# EAGLE design halloween-mask-v2 (EAGLE 9.6.2)
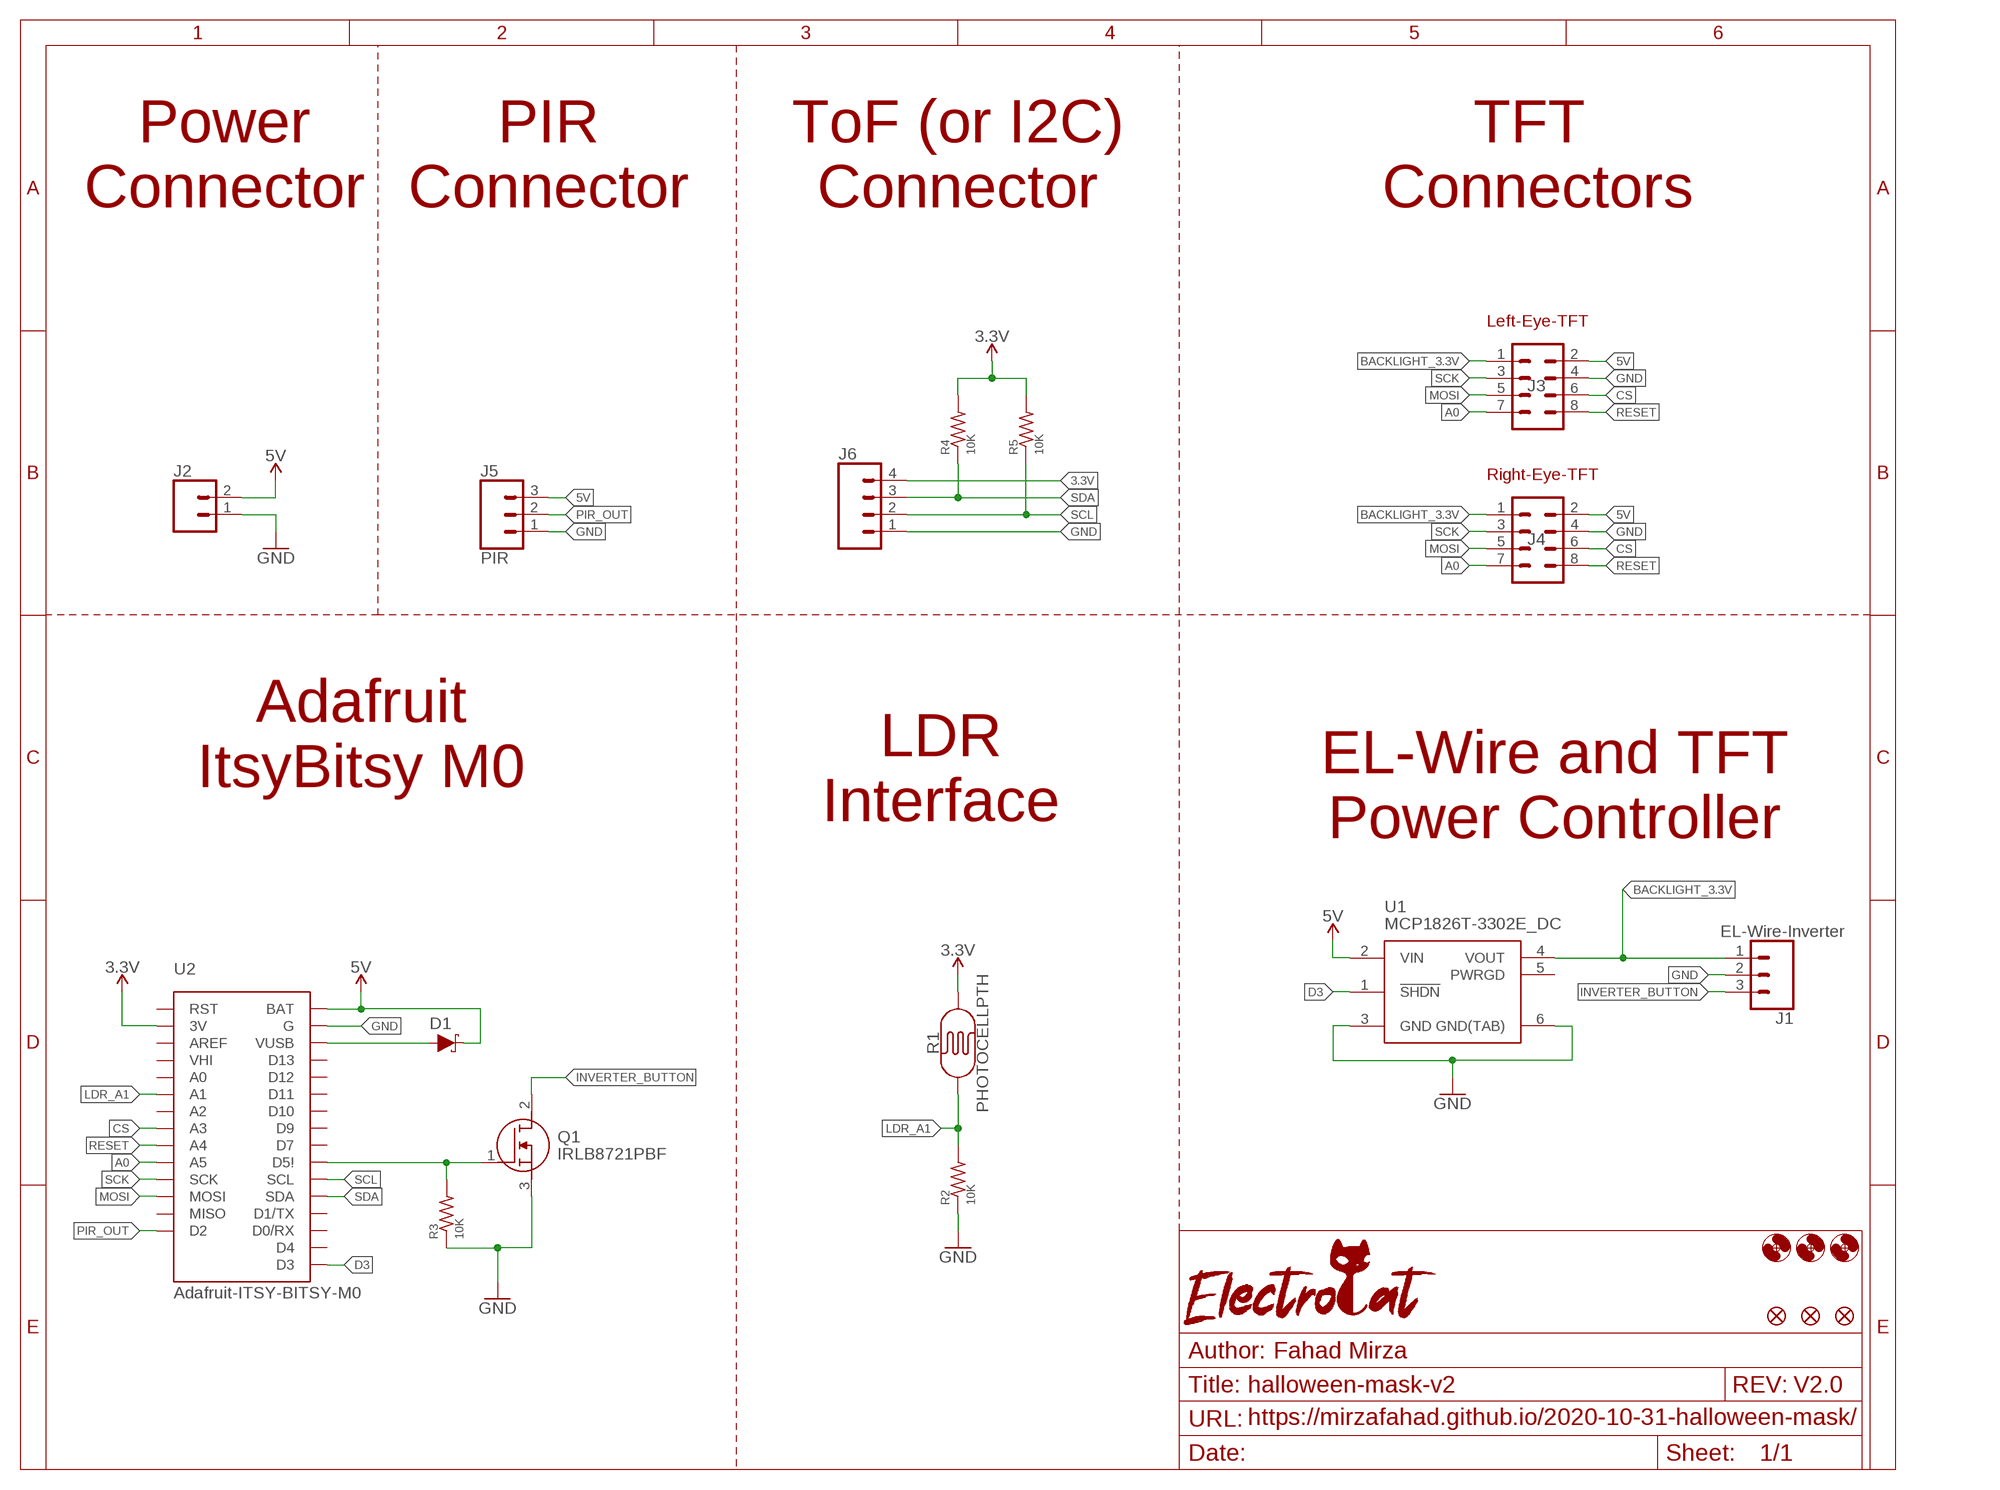
[diagram p0: schematic, sheet 1]

## Parts
D1  DIODE-SCHOTTKY-MBR130T1G  [SOD-123]
FD1  FIDUCIAL0.2MM  [FIDUCIAL-0.2MM]
FD2  FIDUCIAL0.2MM  [FIDUCIAL-0.2MM]
FD3  FIDUCIAL0.2MM  [FIDUCIAL-0.2MM]
H1  MOUNT-HOLE2.8  [2,8]
H2  MOUNT-HOLE2.8  [2,8]
H4  MOUNT-HOLE2.8  [2,8]
J1  EL-Wire-Inverter  CONN_03  [1X03]
J2  CONN_02LOCK  [1X02_LOCK]
J3  CONN_04X2  [2X4]
J4  CONN_04X2  [2X4]
J5  PIR  CONN_03LOCK  [1X03_LOCK]
J6  CONN_04PTH  [1X04]
Q1  IRLB8721PBF  [TO254P483X1016X1994-3P]
R1  PHOTOCELLPTH  [PHOTOCELL]
R2  10K  SMD-RES-1206  [R1206]
R3  10K  SMD-RES-1206  [R1206]
R4  10K  SMD-RES-1206  [R1206]
R5  10K  SMD-RES-1206  [R1206]
U1  MCP1826T-3302E_DC  [SOT127P706X180-6N]
U2  Adafruit-ITSY-BITSY-M0  ITSY-BITSY-LESS-PINS  [ITSY-BITSY-LESS-PINS]

## Nets
3.3V: J6.4 R1.2 R4.2 R5.2 U2.P2(3V)
5V: D1.2(C) J2.2 J3.2 J4.2 J5.3 U1.2(VIN) U2.P28(BAT)
A0: J3.7 J4.7 U2.P10(A5)
BACKLIGHT_3.3V: J1.1 J3.1 J4.1 U1.4(VOUT)
CS: J3.6 J4.6 U2.P8(A3)
D3: U1.1(!SHDN) U2.18(D3)
GND: J1.2 J2.1 J3.4 J4.4 J5.1 J6.1 Q1.3(S) R2.1 R3.1 U1.3(GND) U1.6(GND(TAB)) U2.P27(G)
INVERTER_BUTTON: J1.3 Q1.2(D)
LDR_A1: R1.1 R2.2 U2.P6(A1)
MOSI: J3.5 J4.5 U2.P12(MOSI)
N$1: D1.1(A) U2.P26(VUSB)
N$3: Q1.1(G) R3.2 U2.P19(D5!)
PIR_OUT: J5.2 U2.P14(D2)
RESET: J3.8 J4.8 U2.P9(A4)
SCK: J3.3 J4.3 U2.P11(SCK)
SCL: J6.2 R5.1 U2.P18(SCL)
SDA: J6.3 R4.1 U2.P17(SDA)
Unconnected: U1.5(PWRGD) U2.19(D4) U2.P1(RST) U2.P3(AREF) U2.P4(VHI) U2.P5(A0) U2.P7(A2) U2.P13(MISO) U2.P15(D0/RX) U2.P16(D1/TX) U2.P20(D7) U2.P21(D9) U2.P22(D10) U2.P23(D11) U2.P24(D12) U2.P25(D13)

## Notes on the sheet
- Power
  Connector
- PIR
  Connector
- ToF (or I2C)
  Connector
- TFT 
  Connectors
- Left-Eye-TFT
- Right-Eye-TFT
- Adafruit
  ItsyBitsy M0
- LDR
  Interface
- EL-Wire and TFT
  Power Controller
- V2.0
- https://mirzafahad.github.io/2020-10-31-halloween-mask/

## Library data of the parts
D1 = Personal_DiscreteSemi:DIODE-SCHOTTKY: Schottky diode A Schottky diode is a semiconductor diode which has a low forward voltage drop and a very fast switching action.
FD1-FD3 = SparkFun-Aesthetics:FIDUCIAL: Fiducial Alignment Points Point-of-reference for pick-and-place machines and other optical instruments.
H1 H2 H4 = Personal_Connectors:MOUNT-HOLE: MOUNTING HOLE with drill center marker
J1 = SparkFun-Connectors:CONN_03: Multi connection point. Often used as Generic Header-pin footprint for 0.1 inch spaced/style header connections On any of the 0.1 inch spaced packages, you can populate with these: Break Away Headers - Straight <https://www.sparkfun.com/products/116> (PRT-00116) Break Away Male Headers - Right Angle <https://www.sparkfun.com/products/553> (PRT-00553) Female Headers <https://www.sparkfun.com/products/115> (PRT-00115) Break Away Headers - Machine Pin <https://www.sparkfun.com/products/117> (PRT-00117) Break Away Female Headers - Swiss Machine Pin <https://www.sparkfun.com/products/743> (PRT-00743) Stackable Header - 3 Pin (Female, 0.1") <https://www.sparkfun.com/products/13875> (PRT-13875) For SCREWTERMINALS and SPRING TERMINALS visit here: Screw Terimnals on SparkFun.com <https://www.sparkfun.com/search/results?term=Screw+Terminals> (5mm/3.5mm/2.54mm spacing) This device is also useful as a general connection point to wire up your design to another part of your project. Our various solder wires solder well into these plated through hole pads. Hook-Up Wire - Assortment (Stranded, 22 AWG) <https://www.sparkfun.com/products/11375> (PRT-11375) Hook-Up Wire - Assortment (Solid Core, 22 AWG) <https://www.sparkfun.com/products/11367> (PRT-11367) View the entire wire category on our website here <https://www.sparkfun.com/categories/141> Special notes: Molex polarized connector foot print use with SKU : PRT-08232 with associated crimp pins and housings.; PROD_ID: XXX-00000; VALUE: 455-1750-1-ND
J2 = SparkFun-Connectors:CONN_02: Multi connection point. Often used as Generic Header-pin footprint for 0.1 inch spaced/style header connections On any of the 0.1 inch spaced packages, you can populate with these: Break Away Headers - Straight <https://www.sparkfun.com/products/116> (PRT-00116) Break Away Male Headers - Right Angle <https://www.sparkfun.com/products/553> (PRT-00553) Female Headers <https://www.sparkfun.com/products/115> (PRT-00115) Break Away Headers - Machine Pin <https://www.sparkfun.com/products/117> (PRT-00117) Break Away Female Headers - Swiss Machine Pin <https://www.sparkfun.com/products/743> (PRT-00743) For SCREWTERMINALS and SPRING TERMINALS visit here: Screw Terimnals on SparkFun.com <https://www.sparkfun.com/search/results?term=Screw+Terminals> (5mm/3.5mm/2.54mm spacing) This device is also useful as a general connection point to wire up your design to another part of your project. Our various solder wires solder well into these plated through hole pads. Hook-Up Wire - Assortment (Stranded, 22 AWG) <https://www.sparkfun.com/products/11375> (PRT-11375) Hook-Up Wire - Assortment (Solid Core, 22 AWG) <https://www.sparkfun.com/products/11367> (PRT-11367) View the entire wire category on our website here <https://www.sparkfun.com/categories/141> Special notes: Molex polarized connector foot print use with: PRT-08233 with associated crimp pins and housings. 2.54_SCREWTERM for use with PRT-10571. 3.5mm Screw Terminal footprints for PRT-08084 5mm Screw Terminal footprints for use with PRT-08432
J3 J4 = SparkFun-Connectors:CONN_04X2: Multi connection point. Often used as Generic Header-pin footprint for 0.1 inch spaced/style header connections On any of the 0.1 inch spaced packages, you can populate with these: Break Away Headers - Straight <https://www.sparkfun.com/products/116> (PRT-00116) Break Away Male Headers - Right Angle <https://www.sparkfun.com/products/553> (PRT-00553) Female Headers <https://www.sparkfun.com/products/115> (PRT-00115) Break Away Headers - Machine Pin <https://www.sparkfun.com/products/117> (PRT-00117) Break Away Female Headers - Swiss Machine Pin <https://www.sparkfun.com/products/743> (PRT-00743)
J5 = SparkFun-Connectors:CONN_03: Multi connection point. Often used as Generic Header-pin footprint for 0.1 inch spaced/style header connections On any of the 0.1 inch spaced packages, you can populate with these: Break Away Headers - Straight <https://www.sparkfun.com/products/116> (PRT-00116) Break Away Male Headers - Right Angle <https://www.sparkfun.com/products/553> (PRT-00553) Female Headers <https://www.sparkfun.com/products/115> (PRT-00115) Break Away Headers - Machine Pin <https://www.sparkfun.com/products/117> (PRT-00117) Break Away Female Headers - Swiss Machine Pin <https://www.sparkfun.com/products/743> (PRT-00743) Stackable Header - 3 Pin (Female, 0.1") <https://www.sparkfun.com/products/13875> (PRT-13875) For SCREWTERMINALS and SPRING TERMINALS visit here: Screw Terimnals on SparkFun.com <https://www.sparkfun.com/search/results?term=Screw+Terminals> (5mm/3.5mm/2.54mm spacing) This device is also useful as a general connection point to wire up your design to another part of your project. Our various solder wires solder well into these plated through hole pads. Hook-Up Wire - Assortment (Stranded, 22 AWG) <https://www.sparkfun.com/products/11375> (PRT-11375) Hook-Up Wire - Assortment (Solid Core, 22 AWG) <https://www.sparkfun.com/products/11367> (PRT-11367) View the entire wire category on our website here <https://www.sparkfun.com/categories/141> Special notes: Molex polarized connector foot print use with SKU : PRT-08232 with associated crimp pins and housings.
J6 = SparkFun-Connectors:CONN_04: Multi connection point. Often used as Generic Header-pin footprint for 0.1 inch spaced/style header connections On any of the 0.1 inch spaced packages, you can populate with these: Break Away Headers - Straight <https://www.sparkfun.com/products/116> (PRT-00116) Break Away Male Headers - Right Angle <https://www.sparkfun.com/products/553> (PRT-00553) Female Headers <https://www.sparkfun.com/products/115> (PRT-00115) Break Away Headers - Machine Pin <https://www.sparkfun.com/products/117> (PRT-00117) Break Away Female Headers - Swiss Machine Pin <https://www.sparkfun.com/products/743> (PRT-00743) For SCREWTERMINALS and SPRING TERMINALS visit here: Screw Terimnals on SparkFun.com <https://www.sparkfun.com/search/results?term=Screw+Terminals> (5mm/3.5mm/2.54mm spacing) This device is also useful as a general connection point to wire up your design to another part of your project. Our various solder wires solder well into these plated through hole pads. Hook-Up Wire - Assortment (Stranded, 22 AWG) <https://www.sparkfun.com/products/11375> (PRT-11375) Hook-Up Wire - Assortment (Solid Core, 22 AWG) <https://www.sparkfun.com/products/11367> (PRT-11367) View the entire wire category on our website here <https://www.sparkfun.com/categories/141> Special notes: Molex polarized connector foot print use with SKU : PRT-08231 with associated crimp pins and housings. 1MM SMD Version SKU: PRT-10208; PROD_ID: CONN-09696
Q1 = SamacSys_Parts2:IRLB8721PBF: International Rectifier IRLB8721PBF N-channel MOSFET Transistor, 62 A, 30 V, 3-Pin TO-220AB Source: Datasheet <https://cdn-shop.adafruit.com/datasheets/irlb8721pbf.pdf>; ARROW_PART_NUMBER: IRLB8721PBF; DESCRIPTION: International Rectifier IRLB8721PBF N-channel MOSFET Transistor, 62 A, 30 V, 3-Pin TO-220AB; HEIGHT: 4.83mm; MANUFACTURER_NAME: International Rectifier; MANUFACTURER_PART_NUMBER: IRLB8721PBF
R1 = SparkFun-Sensors:PHOTOCELL: Photocell (Photodetector, Photo Resistor, CdS) This is a very small light sensor. A photocell changes (also called a photodetector, photo resistor, CdS or photoconductive cell) resistance depending on the amount of light it is exposed to. These little sensors make great ambient light triggers (when light in the room turns on, do something). Datasheet <http://cdn.sparkfun.com/datasheets/Sensors/LightImaging/SEN-09088.pdf> SparkFun Products Mini Photocell <https://www.sparkfun.com/products/9088> (SEN-09088); PROD_ID: COMP-09129; SF_ID: SEN-09088
R2-R5 = OPL_Resistor:SMD-RES-1206
U1 = Personal_ICs-Regulators:MCP1826T-3302E_DC: LDO Regulator 1A 3.3V PG SOT223-5 MCP1826T-3302E/DC, Low Dropout Voltage Regulator, 1A, 3.3 V +/-2%, 2.3 6 Vin, 6-Pin SOT-223 Source: Datasheet <http://ww1.microchip.com/downloads/en/DeviceDoc/22057B.pdf>; ARROW_PART_NUMBER: MCP1826T-3302E/DC; ARROW_PRICE-STOCK: https://www.arrow.com/en/products/mcp1826t-3302edc/microchip-technology; DESCRIPTION: LDO Regulator 1A 3.3V PG SOT223-5 MCP1826T-3302E/DC, Low Dropout Voltage Regulator, 1A, 3.3 V +/-2%, 2.3 6 Vin, 6-Pin SOT-223; HEIGHT: 1.8mm; MANUFACTURER_NAME: Microchip; MANUFACTURER_PART_NUMBER: MCP1826T-3302E/DC; MOUSER_PART_NUMBER: 579-MCP1826T-3302EDC; MOUSER_PRICE-STOCK: https://www.mouser.co.uk/ProductDetail/Microchip-Technology/MCP1826T-3302E-DC?qs=php1hWwkCL6wXd5EvIo2DQ%3D%3D
U2 = Personal_ARDUINO:ITSY-BITSY-LESS-PINS

## Board
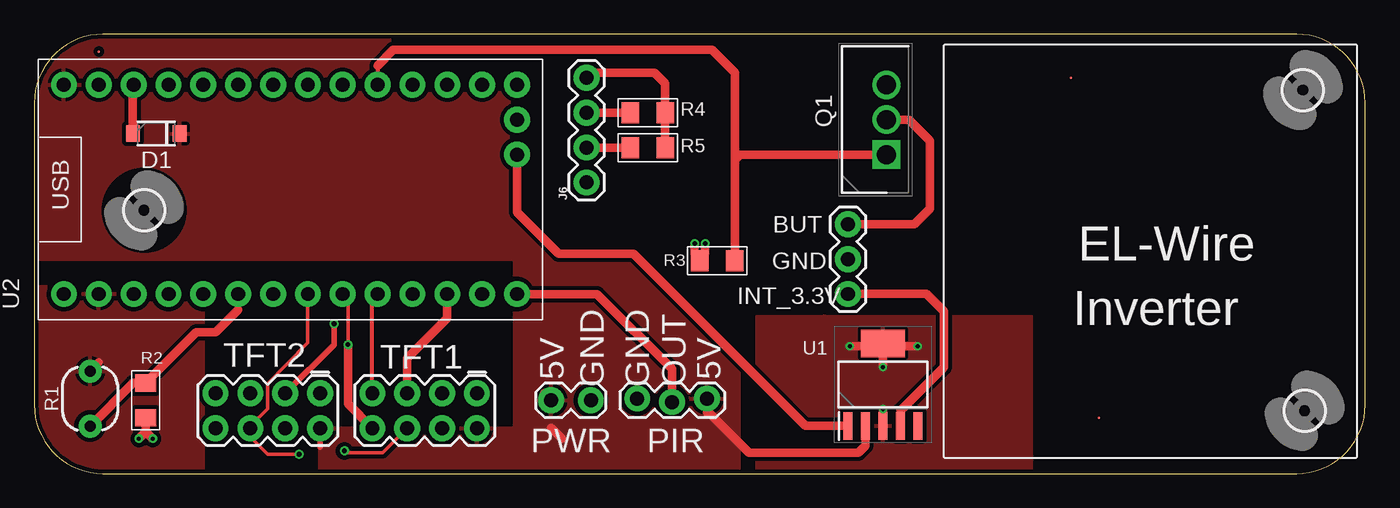
[diagram p1: board, top side]
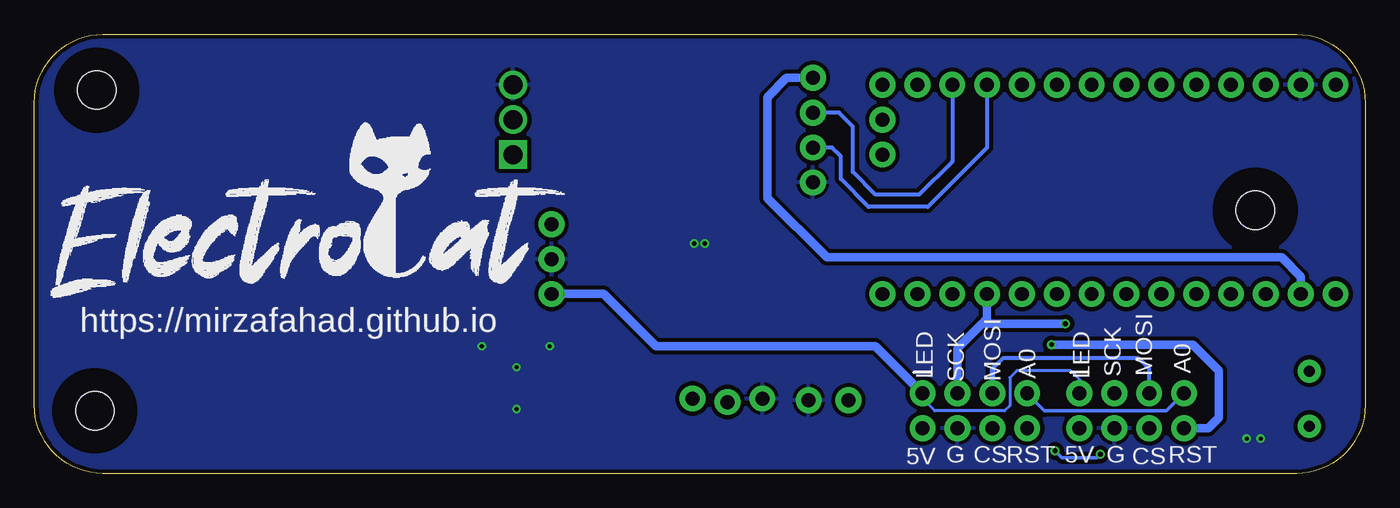
[diagram p2: board, bottom side, seen from below]

Size 97 x 32 mm. Coordinates in mm from the lower left corner, seen from the top.
Outline: 0,27 0,5 arc90 5,0 92,0 arc90 97,5 97,27 arc90 92,32 5,32 arc90 0,27
Copper layers (1*16): Top 0.035mm / dielectric 1.5mm / Bottom 0.035mm
Design rules "SeeedStudio_2layer_DRU_no_angle_20140221": minimum track width 6mil, minimum drill 12mil, track to track 6mil, track to pad 6mil, pad to pad 6mil, via to via 6mil, smd to smd 0mil, copper to edge 10mil, drill to drill 10mil, minimum pad ring 10mil, minimum via ring 6mil, stop-mask expansion 2mil, vias tented up to drill 100mil, thermal gap 10mil

### Footprints (pad centres in the part's own frame; a part is rotated, then mirrored left to right if it is on the bottom)
SOD-123 = smd 1.016 x 1.22: 1 -1.702,0; 2 1.702,0
FIDUCIAL-0.2MM = smd 0.2 x 0.2: 1 0,0
2,8 = hole 2.8: 0,0
1X03 = drill 1.016 pad 1.88: 1 0,0; 2 2.54,0; 3 5.08,0
1X02_LOCK = drill 1.016 pad 1.88: 1 -0.178,0; 2 2.718,0
2X4 = drill 1.016 pad 1.88: 1 -3.81,-1.27; 2 -3.81,1.27; 3 -1.27,-1.27; 4 -1.27,1.27; 5 1.27,-1.27; 6 1.27,1.27; 7 3.81,-1.27; 8 3.81,1.27
1X03_LOCK = drill 1.016 pad 1.88: 1 0,0.127; 2 2.54,-0.127; 3 5.08,0.127
1X04 = drill 1.016 pad 1.88: 1 0,0; 2 2.54,0; 3 5.08,0; 4 7.62,0
TO254P483X1016X1994-3P = drill 1.38 pad 2.07 square: 1 0,0 | drill 1.38 pad 2.07: 2 2.54,0; 3 5.08,0
PHOTOCELL = drill 0.8 pad 1.676: 1 -2,0; 2 2,0
R1206 = smd 1.27 x 1.524: 1 -1.27,0; 2 1.27,0
SOT127P706X180-6N = smd 2 x 0.65: 1 -3,2.54; 2 -3,1.27; 3 -3,0; 4 -3,-1.27; 5 -3,-2.54 | smd 2 x 3.2: 6 3,0
ITSY-BITSY-LESS-PINS = drill 1.016 pad 1.88: 18 2.54,-17.78; 19 5.08,-17.78; P1 -7.62,15.24; P2 -7.62,12.7; P3 -7.62,10.16; P4 -7.62,7.62; P5 -7.62,5.08; P6 -7.62,2.54; P7 -7.62,0; P8 -7.62,-2.54; P9 -7.62,-5.08; P10 -7.62,-7.62; P11 -7.62,-10.16; P12 -7.62,-12.7; P13 -7.62,-15.24; P14 -7.62,-17.78; P15 7.62,-17.78; P16 7.62,-15.24; P17 7.62,-12.7; P18 7.62,-10.16; P19 7.62,-7.62; P20 7.62,-5.08; P21 7.62,-2.54; P22 7.62,0; P23 7.62,2.54; P24 7.62,5.08; P25 7.62,7.62; P26 7.62,10.16; P27 7.62,12.7; P28 7.62,15.24

### Placement (x,y rotation side)
D1  8.89,24.77 0 top
FD1  75.56,28.83 0 top
FD2  4.7,30.73 0 top
FD3  77.6,4.06 0 top
H1  92.46,27.94 0 top
H2  92.58,4.57 0 top
H4  8,19.18 0 top
J1  59.31,13.08 90 top
J2  40.39,5.33 180 top
J3  28.45,4.57 180 top
J4  17.02,4.57 180 top
J5  43.94,5.33 0 top
J6  40.26,21.21 90 top
Q1  62.1,23.24 90 top
R1  4.06,5.46 90 top
R2  8.13,5.33 90 top
R3  49.78,15.49 0 top
R4  44.7,26.29 0 top
R5  44.7,23.75 0 top
U1  61.85,6.48 90 top
U2  17.4,20.7 90 top
U$2  [ELECTROCAT_LOGO_38X14MM]  79.12,13.84 0 top

### Tracks (layer width: path | path; a pad name or v marks a point on that pad's centre or on a via)
3.3V
  Top 0.61: R1.2 4.7,8.1 | R5.2 R4.2 45.97,28.45 45.21,29.21 40.64,29.21 J6.4
  Bottom 0.61: U2.P2 4.7,14.35 6.1,15.75 39.24,15.75 43.56,20.07 43.56,27.43 42.16,28.83 J6.4
  pour Top (isolate 0.305): 2.16,13.59 0,13.59 0,0 12.32,0 12.32,13.59 2.29,13.59
5V
  Top 0.406: 20.83,1.91 J4.2
  Top 0.61: 38.48,2.54 37.67,3.35 | U1.2 60.58,2.03 60.07,1.52 52.07,1.52 49.02,4.57 J5.3 49.02,4.45 | 37.16,5.84 J2.2
  pour Top (isolate 0.305): 0,32 35.18,32 35.18,15.62 0,15.62
  pour Top (isolate 0.305): 20.83,3.3 35.05,3.3 35.05,18.8 51.31,18.8 51.31,0 20.83,0
A0
  Top 0.305: J3.7 24.64,12.7 U2.P10
  Bottom 0.254: J4.7 14.48,4.57 23.37,4.57 J3.7
BACKLIGHT_3.3V
  Top 0.61: U1.4 63.12,4.57 66.29,7.75 66.29,11.81 65.02,13.08 J1.1
  Bottom 0.203: J4.1 20.83,6.86 21.46,7.49 25.4,7.49 25.91,6.99 25.91,4.95 26.29,4.57 31.37,4.57 32.26,5.46 J3.1
  Bottom 0.61: J3.1 35.69,9.27 51.69,9.27 55.5,13.08 J1.1
CS  (via drill 0.35)
  Top 0.254: J3.6 25.4,1.52 22.73,1.52 v22.61,1.65 | v19.3,1.4 17.02,1.4 15.75,2.67 J4.6 15.75,3.49 17.02,4.71 17.02,6.55 19.94,9.53 U2.P8
  Bottom 0.254: v22.61,1.65 22.1,1.14 19.56,1.14 v19.3,1.4
D3
  Top 0.61: U2.18 35.18,19.05 38.23,16 43.69,16 56.21,3.48 U1.1
GND  (via drill 0.3)
  Top 0.61: 8.13,3.05 v7.62,2.54 | R2.1 8.13,3.05 | 8.13,3.05 v8.64,2.54 | 48.51,15.62 48.13,16 v48.13,16.76 | R3.1 48.51,15.62 | 48.51,15.62 48.9,16 v48.9,16.76 | U1.3 v61.85,4.7 | U1.6 v61.85,7.75 | U1.6 62.05,9.27 v64.39,9.27 | U1.6 61.64,9.27 v59.44,9.27
  pour Bottom (isolate 0.305): 0,32 97.03,32 97.03,0 0,0
  pour Top (isolate 0.305): 57.66,11.43 72.64,11.43 72.64,0 52.7,0 52.7,11.3 52.7,11.43 57.53,11.43
INVERTER_BUTTON
  Top 0.61: J1.3 64.14,18.16 65.28,19.3 65.28,24.26 63.75,25.78 Q1.2
LDR_A1
  Top 0.305: 14.86,11.94 U2.P6
  Top 0.61: R1.1 7.21,6.6 R2.2 11.81,10.29 13.21,10.29 14.86,11.94
MOSI
  Top 0.61: J3.5 27.18,8.38 30.1,11.3 U2.P12
  Bottom 0.305: J4.5 15.75,7.62 16.51,8.38 26.42,8.38 27.18,7.62
  Bottom 0.406: 27.18,7.62 J3.5
N$1
  Top 0.61: D1.1 7.19,28.27 U2.P26
N$3
  Top 0.305: 25.02,29.72 U2.P19
  Top 0.61: Q1.1 51.44,23.24 51.05,22.86 R3.2 51.05,29.21 49.4,30.86 26.16,30.86 25.02,29.72
PIR_OUT
  Top 0.61: J5.2 46.48,7.62 41.02,13.08 U2.P14
RESET  (via drill 0.35)
  Top 0.254: v22.86,9.4 22.86,12.7 U2.P9
  Top 0.61: J3.8 22.86,5.08 v22.86,9.4
  Bottom 0.61: J4.8 11.43,3.3 10.67,4.06 10.67,7.49 12.57,9.4 v22.86,9.4
SCK  (via drill 0.35)
  Top 0.406: v21.84,10.92 21.84,9.4 J4.3
  Bottom 0.61: 27.94,10.92 29.72,9.14 J3.3 | v21.84,10.92 27.94,10.92 | 27.94,10.92 27.56,11.3 U2.P11
SCL
  Top 0.61: J6.2 R5.1
  Bottom 0.305: U2.P18 27.56,23.75 31.88,19.43 36.2,19.43 38.23,21.46 38.23,23.11 38.86,23.75 J6.2
SDA
  Top 0.61: J6.3 R4.1
  Bottom 0.305: U2.P17 30.1,22.73 32.51,20.32 35.69,20.32 37.34,21.97 37.34,25.27 38.35,26.29 J6.3

### Text on the board
tPlace: BUT | GND | EL-Wire | INT_3.3V | Inverter | TFT2 | TFT1 | GND | GND | OUT | 5V | 5V | PWR | PIR
bPlace: https://mirzafahad.github.io | MOSI | SCK | LED | MOSI | SCK | LED | A0 | A0 | RST | CS | G | 5V | RST | CS | G | 5V